# EAGLE schematic Schaltplan (EAGLE 9.7.0)
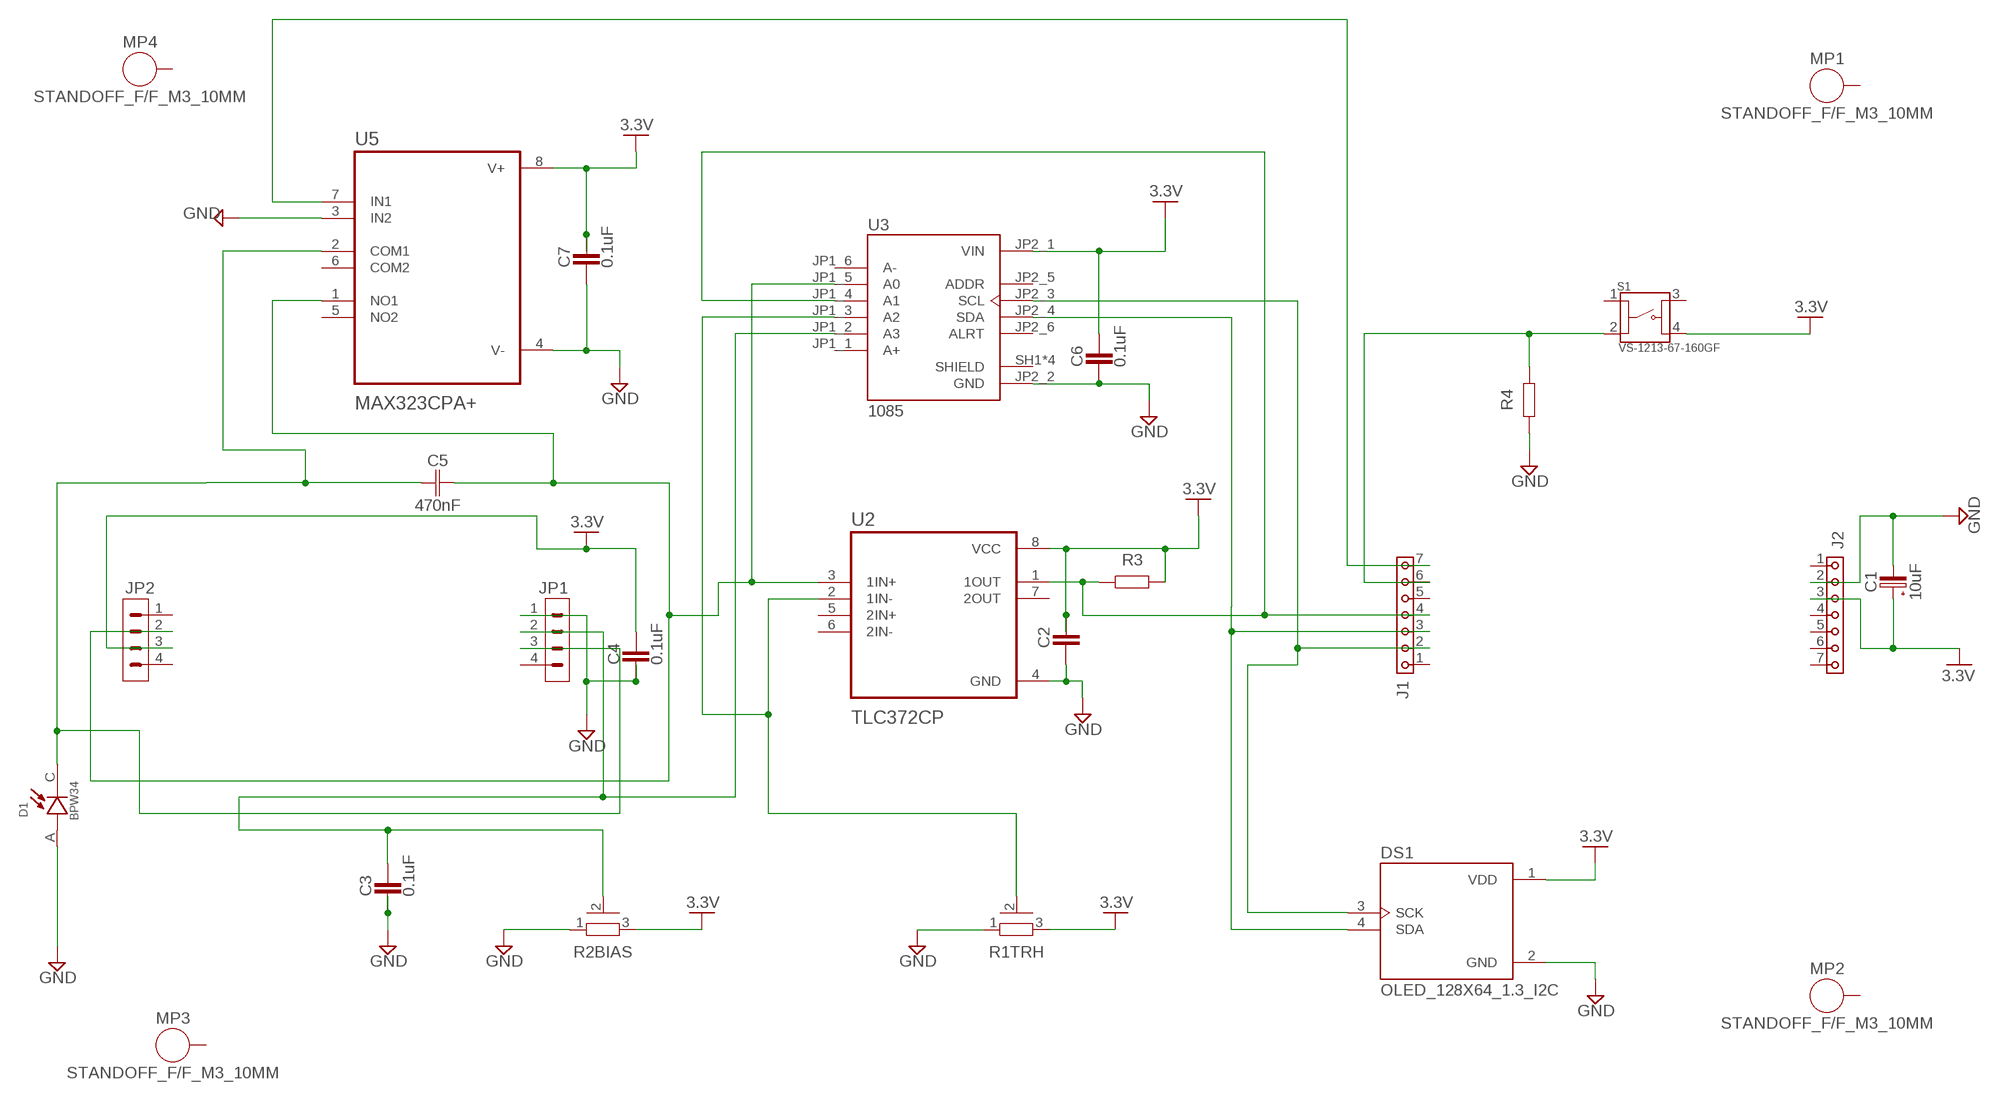
[diagram p0: schematic, sheet 1]

## Parts
C1  10uF  C-POL_RADIAL-11MM-DIA  [CAPPRD508W65D1000H1100B]
C2  CAPACITORCERAMIC-2.54MM  [CAP-THRU-2.54MM]
C3  0.1uF  CAPACITORCERAMIC-2.54MM  [CAP-THRU-2.54MM]
C4  0.1uF  CAPACITORCERAMIC-2.54MM  [CAP-THRU-2.54MM]
C5  470nF  C_RADIAL-12.5MM-DIA  [CAPRD550W60D1025H1250B]
C6  0.1uF  CAPACITORCERAMIC-2.54MM  [CAP-THRU-2.54MM]
C7  0.1uF  CAPACITORCERAMIC-2.54MM  [CAP-THRU-2.54MM]
D1  BPW34  [DIO_BPW34]
DS1  OLED_128X64_1.3_I2C  [LCD_OLED_128X64_1.3_I2C]
J1  6130XX11821_61300711821  [61300711821]
J2  6130XX11821_61300711821  [61300711821]
JP1  PINHD-1X4  [1X04]
JP2  PINHD-1X4  [1X04]
MP1  STANDOFF_F/F_M3_10MM  [STANDOFF_HEX_FEMALE_550X1000_M3X0.5_MTGP850H320]
MP2  STANDOFF_F/F_M3_10MM  [STANDOFF_HEX_FEMALE_550X1000_M3X0.5_MTGP850H320]
MP3  STANDOFF_F/F_M3_10MM  [STANDOFF_HEX_FEMALE_550X1000_M3X0.5_MTGP850H320]
MP4  STANDOFF_F/F_M3_10MM  [STANDOFF_HEX_FEMALE_550X1000_M3X0.5_MTGP850H320]
R1TRH  PV36Y  [PV36Y]
R2BIAS  PV36Y  [PV36Y]
R3  R_AXIAL-11.7MM-PITCH  [RESAD1176W63L850D250B]
R4  R_AXIAL-11.7MM-PITCH  [RESAD1176W63L850D250B]
S1  VS-1213-67-160GF  [SW_VS-1213-67-160GF]
U2  TLC372CP  [DIP794W45P254L959H508Q8]
U3  1085  [MODULE_1085]
U5  MAX323CPA+  [DIP794W47P254L991H457Q8]

## Nets
3.3V: C1.1(+) C2.1 C4.1 C6.1 C7.1 DS1.1(VDD) J2.3 JP2.3 R1TRH.3 R2BIAS.3 R3.2 S1.4 U2.8(VCC) U3.JP2_1(VIN) U5.8(V+)
GND: C1.2(-) C2.2 C3.2 C4.2 C6.2 C7.2 D1.A DS1.2(GND) J2.2 JP1.1 R1TRH.1 R2BIAS.1 R4.1 U2.4(GND) U3.JP2_2(GND) U5.3(IN2) U5.4(V-)
N$4: C3.1 JP1.2 R2BIAS.2 U3.JP1_2(A3)
N$5: R1TRH.2 U2.2(1IN-) U3.JP1_3(A2)
N$8: J1.7 U5.7(IN1)
N$9: J1.6 R4.2 S1.2
N$11: J1.4 R3.1 U2.1(1OUT) U3.JP1_4(A1)
N$12: DS1.4(SDA) J1.3 U3.JP2_4(SDA)
N$13: DS1.3(SCK) J1.2 U3.JP2_3(SCL)
N$17: C5.2 JP2.2 U2.3(1IN+) U3.JP1_5(A0) U5.1(NO1)
N$22: C5.1 D1.C JP1.3 U5.2(COM1)
Unconnected: J1.1 J1.5 J2.1 J2.4 J2.5 J2.6 J2.7 JP1.4 JP2.1 JP2.4 MP1.1 MP2.1 MP3.1 MP4.1 S1.1 S1.3 U2.5(2IN+) U2.6(2IN-) U2.7(2OUT) U3.JP1_1(A+) U3.JP1_6(A-) U3.JP2_5(ADDR) U3.JP2_6(ALRT) U3.SH1(SHIELD) U3.SH2(SHIELD) U3.SH3(SHIELD) U3.SH4(SHIELD) U5.5(NO2) U5.6(COM2)

## Library data of the parts
C1 = Capacitor:C-POL: Capacitor Polarised - Generic; CATEGORY: Capacitor; PACKAGE_SIZE: 11MM-DIA; PACKAGE_TYPE: Through Hole; SUBCATEGORY: Aluminum Electrolytic Capacitors; TYPE: Radial Can
C2-C4 C6 C7 = Tinkercad:CAPACITOR: Capacitor - Generic
C5 = Capacitor:C: Capacitor - Generic; CATEGORY: Capacitor; PACKAGE_SIZE: 12.5MM-DIA; PACKAGE_TYPE: Through Hole; SUBCATEGORY: Aluminum Non-Polar Capacitors; TYPE: Radial Can
D1 = BPW34:BPW34: Check availability <https://pricing.snapeda.com/parts/BPW34/Vishay%20Semiconductor/view-part?ref=eda>; AVAILABILITY: In Stock; CHECK_PRICES: https://www.snapeda.com/parts/BPW34/Vishay/view-part/?ref=eda; DESCRIPTION: Photodiode 900nm - 130° 2-DIP (0.200, 5.10mm); MF: Vishay Semiconductor; MP: BPW34; PACKAGE: None; PRICE: None; SNAPEDA_LINK: https://www.snapeda.com/parts/BPW34/Vishay/view-part/?ref=snap
DS1 = OLED_128X64_1.3_I2C:OLED_128X64_1.3_I2C: Check availability <https://pricing.snapeda.com/parts/OLED%20128x64%201.3%26quot%3B%20I2C/UNIVERSAL-SOLDER%20Electronics%20Ltd/view-part?ref=eda>; AVAILABILITY: Not in stock; CHECK_PRICES: https://www.snapeda.com/parts/OLED%20128x64%201.3%22%20I2C/UNIVERSAL-SOLDER+Electronics+Ltd/view-part/?ref=eda; DESCRIPTION: Non-Touch Graphic LCD Display Module Transmissive White OLED, Monochrome I2C 1.3 (33.02mm) 128 x 64; MF: UNIVERSAL-SOLDER Electronics Ltd; MP: OLED 128x64 1.3&quot; I2C; PACKAGE: None; PRICE: None; SNAPEDA_LINK: https://www.snapeda.com/parts/OLED%20128x64%201.3%22%20I2C/UNIVERSAL-SOLDER+Electronics+Ltd/view-part/?ref=snap
J1 J2 = 6130XX11821_61300711821:6130XX11821_61300711821: Check availability <https://pricing.snapeda.com/parts/61300711821/W%C3%BCrth%20Elektronik/view-part?ref=eda>; AVAILABILITY: In Stock; CHECK_PRICES: https://www.snapeda.com/parts/61300711821/W%25C3%25BCrth+Elektronik+Midcom/view-part/?ref=eda; DESCRIPTION: Single Row / Straight / Without Shroud Female header Female 7 | Würth Elektronik 61300711821 @ Pin header, socket (Si...; MF: Würth Elektronik; MP: 61300711821; PACKAGE: None; PRICE: None; SNAPEDA_LINK: https://www.snapeda.com/parts/61300711821/W%25C3%25BCrth+Elektronik+Midcom/view-part/?ref=snap
JP1 JP2 = Connector:PINHD-1X4: Pin Header; CATEGORY: Connectors; DESCRIPTION: Header-Straight-4 Position; PACKAGE_TYPE: Through Hole; PITCH: 0.100" (2.54mm); SUBCATEGORY: Headers; TYPE: Male Pins
MP1-MP4 = PCB-Fasteners_Hardware:STANDOFF_F/F: Female-Female Standoff/Spacer with Mounting pad and hole. Essentra : Female Standoff <https://www.essentracomponents.co.in/index.php?option=com_virtuemart&view=productdetails&virtuemart_product_id=14493> The hole and pad sizes may vary based on the application and type of hardware; always verify the Manufacturer specification or Global Standards.; CATEGORY: Standoff/Spacer; DESCRIPTION: Hex Standoff Threaded M3 10 mm; HEIGHT: 10 mm; PACKAGE_SIZE: NA; PACKAGE_TYPE: NA; SUBCATEGORY: Female-Female; THREADED: Threaded; THREAD_SIZE: M3; TYPE: Hex Standoff
R1TRH R2BIAS = Resistor:PV36: Rectangular Trimmer Potentiometers - PV36 Series Reference: Datasheet <https://www.bourns.com/docs/Product-Datasheets/pv36.pdf>; CATEGORY: Potentiometers; DATASHEET: https://www.bourns.com/docs/Product-Datasheets/pv36.pdf; DESCRIPTION: 0.5W 1/2W PC Pins Through Hole Trimmer Potentiometer Cermet 25.0 Turn Top Adjustment; MANUFACTURER: Bourns Inc.; MPN: PV36Yx; OPERATING_TEMPERATURE: -55°C ~ 125°C; PACKAGE_SIZE: NA; PACKAGE_TYPE: Through Hole; PART_STATUS: Active; ROHS: Compliant; SERIES: PV36; SUBCATEGORY: Trimmer Potentiometers; TEMPERATURE_COEFFICIENT: ±100ppm/°C; THERMALLOSS: 0.5 W; TOLERANCE: ±10%; TYPE: Top Adjustment Triangle Leads
R3 R4 = Resistor:R: Resistor Fixed - Generic; CATEGORY: Resistors; DESCRIPTION: Axial Resistor 11.76 mm pitch 8.5 mm body length 2.5 mm body diameter; PACKAGE_SIZE: Axial; PACKAGE_TYPE: Through Hole
S1 = VS-1213-67-160GF:VS-1213-67-160GF: Check availability <https://pricing.snapeda.com/parts/VS-1213-67-160GF/Valcon/view-part?ref=eda>; AVAILABILITY: In Stock; CHECK_PRICES: https://www.snapeda.com/parts/VS-1213-67-160GF/Valcon/view-part/?ref=eda; DESCRIPTION: Valcon 12 x 12mm PCB Mount Flat Tactile Switch; MF: Valcon; MP: VS-1213-67-160GF; PACKAGE: None; PRICE: None; SNAPEDA_LINK: https://www.snapeda.com/parts/VS-1213-67-160GF/Valcon/view-part/?ref=snap
U2 = TLC372CP:TLC372CP: Check availability <https://pricing.snapeda.com/parts/TLC372CP/Texas%20Instruments/view-part?ref=eda>; AVAILABILITY: In Stock; CHECK_PRICES: https://www.snapeda.com/parts/TLC372CP/Texas+Instruments/view-part/?ref=eda; DESCRIPTION: Dual General Purpose LinCMOS™ Differential Comparator; MF: Texas Instruments; MP: TLC372CP; PACKAGE: PDIP-8 Texas; PRICE: None; SNAPEDA_LINK: https://www.snapeda.com/parts/TLC372CP/Texas+Instruments/view-part/?ref=snap
U3 = 1085:1085: Check availability <https://pricing.snapeda.com/parts/1085/Adafruit%20Industries/view-part?ref=eda>; AVAILABILITY: In Stock; CHECK_PRICES: https://www.snapeda.com/parts/1085/Adafruit+Industries/view-part/?ref=eda; DESCRIPTION: ADS1115 series 16 Bit 860 Samples per Second Analog to Digital Converter (ADC) Evaluation Board; MF: Adafruit Industries; MP: 1085; PACKAGE: NON STANDARD-16 Adafruit; PRICE: None; SNAPEDA_LINK: https://www.snapeda.com/parts/1085/Adafruit+Industries/view-part/?ref=snap
U5 = MAX323CPA_:MAX323CPA+: Check availability <https://pricing.snapeda.com/parts/MAX323CPA%2B/Analog%20Devices/view-part?ref=eda>; AVAILABILITY: In Stock; CHECK_PRICES: https://www.snapeda.com/parts/MAX323CPA+/Analog+Devices/view-part/?ref=eda; DESCRIPTION: Analog Switch Dual SPST 8-Pin PDIP N Tube; MF: Analog Devices; MP: MAX323CPA+; PACKAGE: PDIP-8 Maxim; PRICE: None; SNAPEDA_LINK: https://www.snapeda.com/parts/MAX323CPA+/Analog+Devices/view-part/?ref=snap